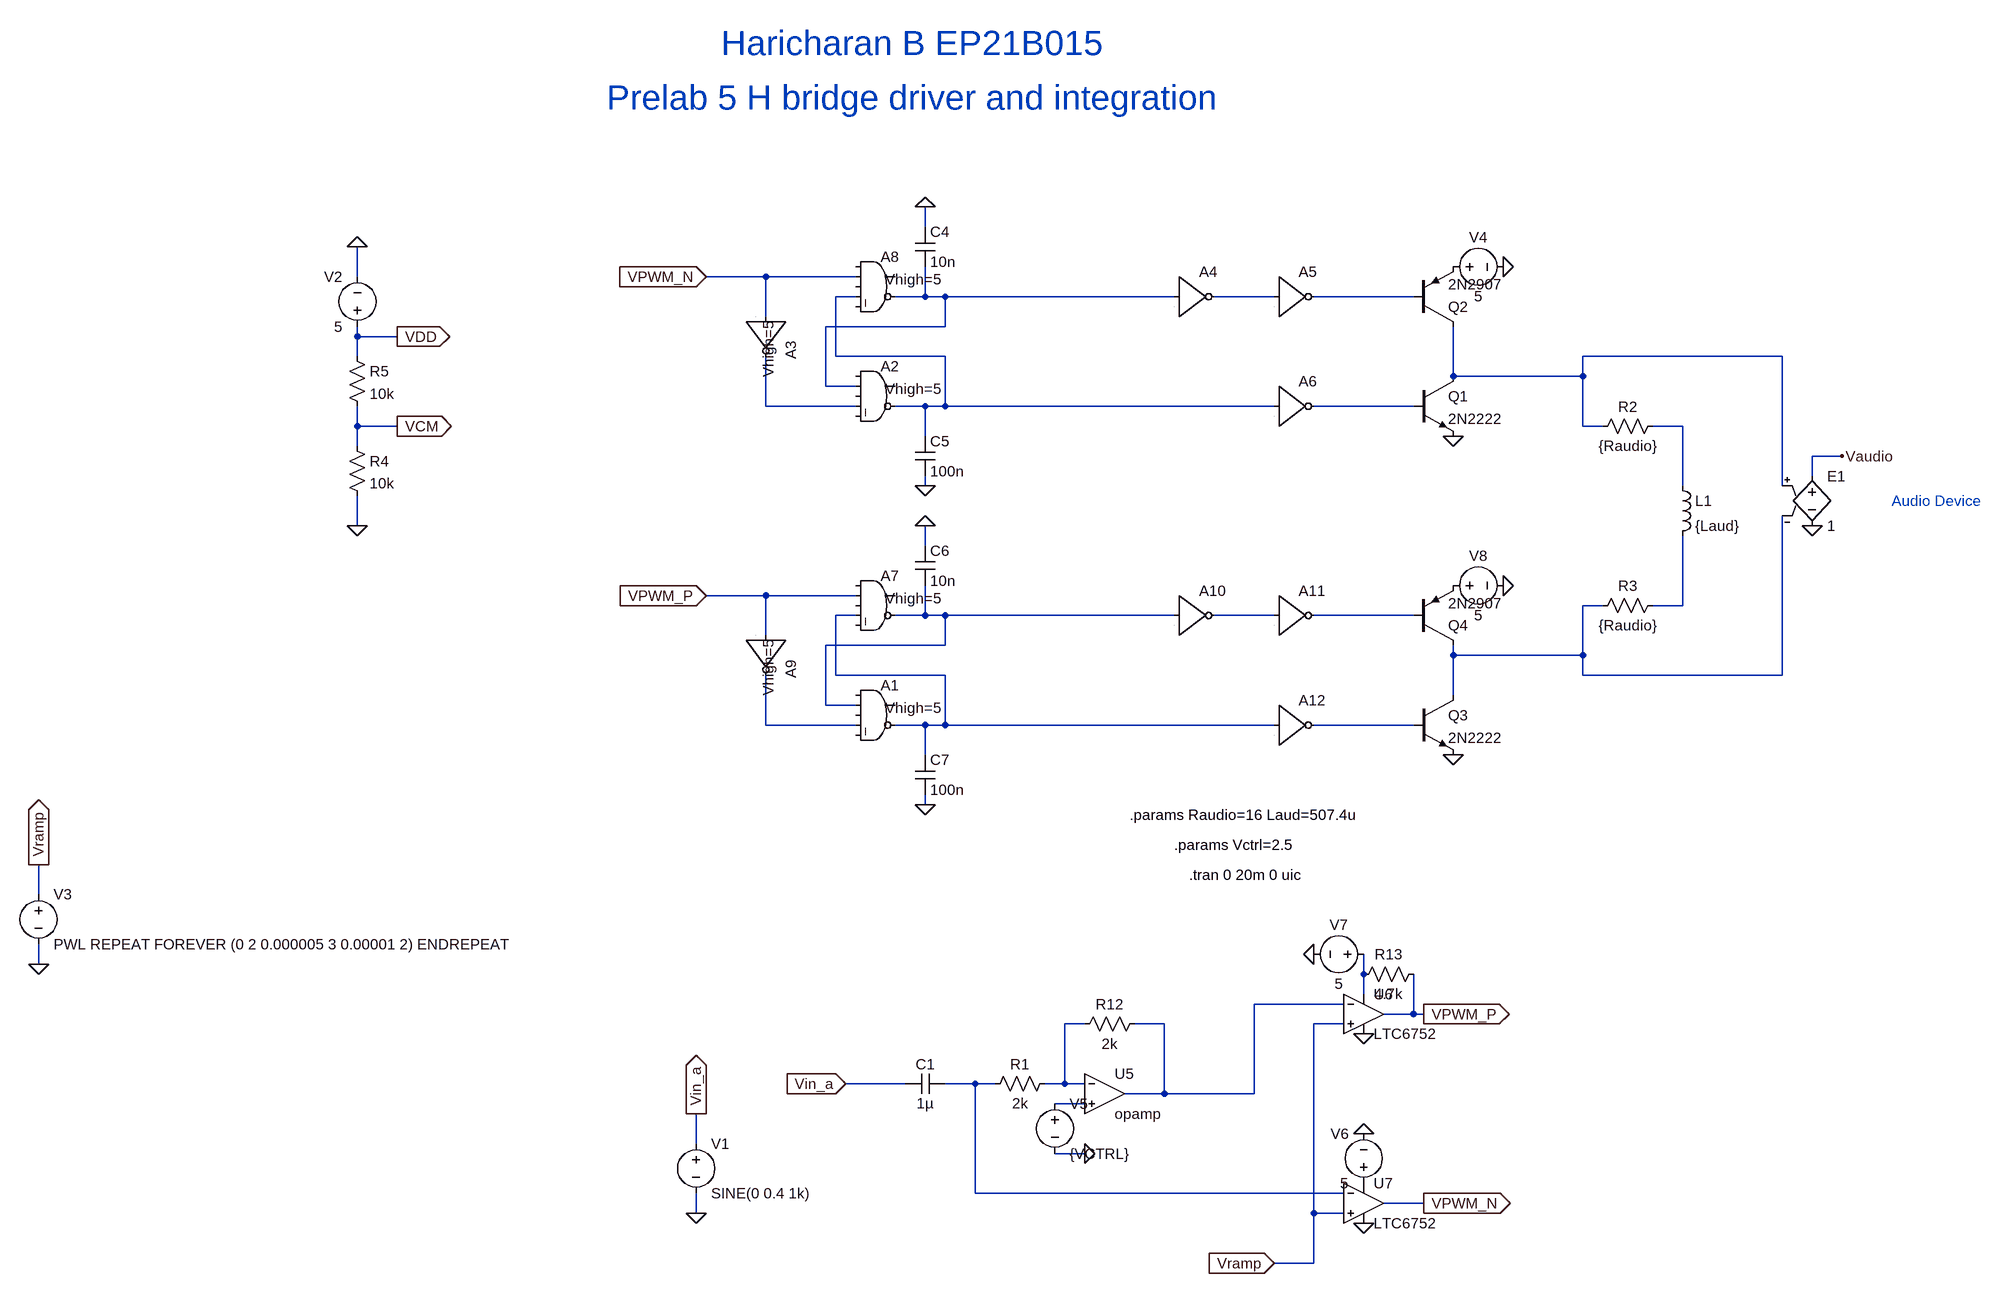
[diagram p0: schematic lab_expt_5.asc]
lab_expt_5.asc, the LTspice schematic file:
Version 4
SHEET 1 2520 1684
WIRE 816 -64 816 -96
WIRE -96 16 -96 -32
WIRE 560 16 464 16
WIRE 704 16 560 16
WIRE 704 48 672 48
WIRE 816 48 816 0
WIRE 816 48 768 48
WIRE 848 48 816 48
WIRE 1216 48 848 48
WIRE 1376 48 1280 48
WIRE 1600 48 1440 48
WIRE 560 80 560 16
WIRE 848 96 848 48
WIRE 848 96 656 96
WIRE -96 112 -96 96
WIRE -32 112 -96 112
WIRE -96 144 -96 112
WIRE 672 144 672 48
WIRE 848 144 672 144
WIRE 2192 144 1872 144
WIRE 1664 176 1664 96
WIRE 1872 176 1872 144
WIRE 1872 176 1664 176
WIRE 656 192 656 96
WIRE 704 192 656 192
WIRE 560 224 560 144
WIRE 704 224 560 224
WIRE 816 224 768 224
WIRE 848 224 848 144
WIRE 848 224 816 224
WIRE 1376 224 848 224
WIRE 1600 224 1440 224
WIRE -96 256 -96 224
WIRE -32 256 -96 256
WIRE 1872 256 1872 176
WIRE 1904 256 1872 256
WIRE 2032 256 1984 256
WIRE 816 272 816 224
WIRE -96 288 -96 256
WIRE 2288 304 2240 304
WIRE 2240 336 2240 304
WIRE 816 352 816 336
WIRE 2032 352 2032 256
WIRE 2192 352 2192 144
WIRE -96 416 -96 368
WIRE 816 448 816 416
WIRE 560 528 464 528
WIRE 704 528 560 528
WIRE 1904 544 1872 544
WIRE 2032 544 2032 432
WIRE 2032 544 1984 544
WIRE 704 560 672 560
WIRE 816 560 816 512
WIRE 816 560 768 560
WIRE 848 560 816 560
WIRE 1216 560 848 560
WIRE 1376 560 1280 560
WIRE 1600 560 1440 560
WIRE 560 592 560 528
WIRE 848 608 848 560
WIRE 848 608 656 608
WIRE 1664 624 1664 608
WIRE 1872 624 1872 544
WIRE 1872 624 1664 624
WIRE 672 656 672 560
WIRE 848 656 672 656
WIRE 1872 656 1872 624
WIRE 2192 656 2192 400
WIRE 2192 656 1872 656
WIRE 1664 688 1664 624
WIRE 656 704 656 608
WIRE 704 704 656 704
WIRE 560 736 560 656
WIRE 704 736 560 736
WIRE 816 736 768 736
WIRE 848 736 848 656
WIRE 848 736 816 736
WIRE 1376 736 848 736
WIRE 1600 736 1440 736
WIRE 816 784 816 736
WIRE 816 864 816 848
WIRE -608 1008 -608 960
WIRE -608 1120 -608 1088
WIRE 1520 1136 1520 1104
WIRE 1520 1168 1520 1136
WIRE 1488 1184 1344 1184
WIRE 1600 1200 1600 1136
WIRE 1600 1200 1552 1200
WIRE 1616 1200 1600 1200
WIRE 1072 1216 1040 1216
WIRE 1200 1216 1152 1216
WIRE 1488 1216 1440 1216
WIRE 784 1312 688 1312
WIRE 896 1312 848 1312
WIRE 928 1312 896 1312
WIRE 1040 1312 1040 1216
WIRE 1040 1312 1008 1312
WIRE 1072 1312 1040 1312
WIRE 1200 1328 1200 1216
WIRE 1200 1328 1136 1328
WIRE 1344 1328 1344 1184
WIRE 1344 1328 1200 1328
WIRE 1072 1344 1024 1344
WIRE 448 1408 448 1360
WIRE 1072 1424 1024 1424
WIRE 896 1488 896 1312
WIRE 1488 1488 896 1488
WIRE 1616 1504 1552 1504
WIRE 448 1520 448 1488
WIRE 1440 1520 1440 1216
WIRE 1488 1520 1440 1520
WIRE 1440 1600 1440 1520
WIRE 1440 1600 1376 1600
FLAG 448 1520 0
FLAG 448 1360 Vin_a
IOPIN 448 1360 Out
FLAG -96 416 0
FLAG -96 -32 0
FLAG -32 112 VDD
IOPIN -32 112 Out
FLAG -32 256 VCM
IOPIN -32 256 Out
FLAG -608 960 Vramp
IOPIN -608 960 Out
FLAG -608 1120 0
FLAG 816 352 0
FLAG 816 -96 0
FLAG 464 16 VPWM_N
IOPIN 464 16 In
FLAG 816 864 0
FLAG 816 416 0
FLAG 464 528 VPWM_P
IOPIN 464 528 In
FLAG 1376 1600 Vramp
IOPIN 1376 1600 In
FLAG 1520 1232 0
FLAG 1520 1536 0
FLAG 1072 1424 0
FLAG 1520 1392 0
FLAG 1440 1104 0
FLAG 688 1312 Vin_a
IOPIN 688 1312 In
FLAG 1616 1200 VPWM_P
IOPIN 1616 1200 Out
FLAG 1616 1504 VPWM_N
IOPIN 1616 1504 Out
FLAG 2240 416 0
FLAG 2288 304 Vaudio
FLAG 1744 0 0
FLAG 1664 272 0
FLAG 1744 512 0
FLAG 1664 784 0
SYMBOL voltage 448 1392 R0
WINDOW 123 0 0 Left 0
WINDOW 39 0 0 Left 0
SYMATTR InstName V1
SYMATTR Value SINE(0 0.4 1k)
SYMBOL res -112 272 R0
SYMATTR InstName R4
SYMATTR Value 10k
SYMBOL res -112 128 R0
SYMATTR InstName R5
SYMATTR Value 10k
SYMBOL voltage -96 112 R180
WINDOW 0 24 96 Left 2
WINDOW 3 24 16 Left 2
WINDOW 123 0 0 Left 0
WINDOW 39 0 0 Left 0
SYMATTR InstName V2
SYMATTR Value 5
SYMBOL voltage -608 992 R0
SYMATTR InstName V3
SYMATTR Value PWL REPEAT FOREVER (0 2 0.000005 3 0.00001 2) ENDREPEAT
SYMBOL Digital\\inv 624 80 R90
WINDOW 3 8 60 Left 2
SYMATTR Value Vhigh=5
SYMATTR InstName A3
SYMBOL cap 800 -64 R0
SYMATTR InstName C4
SYMATTR Value 10n
SYMBOL cap 800 272 R0
SYMATTR InstName C5
SYMATTR Value 100n
SYMBOL npn 1600 176 R0
SYMATTR InstName Q1
SYMATTR Value 2N2222
SYMBOL pnp 1600 96 M180
SYMATTR InstName Q2
SYMATTR Value 2N2907
SYMBOL Digital\\and 736 480 R0
WINDOW 3 16 52 Left 2
SYMATTR Value Vhigh=5
SYMATTR InstName A7
SYMBOL Digital\\inv 624 592 R90
WINDOW 3 8 60 Left 2
SYMATTR Value Vhigh=5
SYMATTR InstName A9
SYMBOL cap 800 448 R0
SYMATTR InstName C6
SYMATTR Value 10n
SYMBOL cap 800 784 R0
SYMATTR InstName C7
SYMATTR Value 100n
SYMBOL Digital\\inv 1216 496 R0
SYMATTR InstName A10
SYMATTR Value2 Vhigh=5 td=200n
SYMBOL npn 1600 688 R0
SYMATTR InstName Q3
SYMATTR Value 2N2222
SYMBOL pnp 1600 608 M180
SYMATTR InstName Q4
SYMATTR Value 2N2907
SYMBOL cap 848 1296 R90
WINDOW 0 0 32 VBottom 2
WINDOW 3 32 32 VTop 2
SYMATTR InstName C1
SYMATTR Value 1µ
SYMBOL res 1024 1296 R90
WINDOW 0 0 56 VBottom 2
WINDOW 3 32 56 VTop 2
SYMATTR InstName R1
SYMATTR Value 2k
SYMBOL opamp 1104 1264 R0
SYMATTR InstName U5
SYMBOL res 1168 1200 R90
WINDOW 0 0 56 VBottom 2
WINDOW 3 32 56 VTop 2
SYMATTR InstName R12
SYMATTR Value 2k
SYMBOL Comparators\\LTC6752 1520 1136 R0
SYMATTR InstName U6
SYMBOL Comparators\\LTC6752 1520 1440 R0
SYMATTR InstName U7
SYMBOL res 1616 1120 R90
WINDOW 0 0 56 VBottom 2
WINDOW 3 32 56 VTop 2
SYMATTR InstName R13
SYMATTR Value 4.7k
SYMBOL voltage 1024 1328 R0
SYMATTR InstName V5
SYMATTR Value {VCTRL}
SYMBOL voltage 1520 1488 R180
WINDOW 0 24 96 Left 2
WINDOW 3 24 16 Left 2
WINDOW 123 0 0 Left 0
WINDOW 39 0 0 Left 0
SYMATTR InstName V6
SYMATTR Value 5
SYMBOL voltage 1536 1104 R90
WINDOW 0 -32 56 VBottom 2
WINDOW 3 32 56 VTop 2
SYMATTR InstName V7
SYMATTR Value 5
SYMBOL Digital\\and 736 656 R0
WINDOW 3 16 52 Left 2
SYMATTR Value Vhigh=5
SYMATTR InstName A1
SYMBOL Digital\\and 736 144 R0
WINDOW 3 16 52 Left 2
SYMATTR Value Vhigh=5
SYMATTR InstName A2
SYMBOL Digital\\and 736 -32 R0
WINDOW 3 16 52 Left 2
SYMATTR Value Vhigh=5
SYMATTR InstName A8
SYMBOL Digital\\inv 1216 -16 R0
SYMATTR InstName A4
SYMATTR Value2 Vhigh=5
SYMBOL Digital\\inv 1376 -16 R0
SYMATTR InstName A5
SYMATTR Value2 Vhigh=5 Rout=1u
SYMBOL Digital\\inv 1376 160 R0
SYMATTR InstName A6
SYMATTR Value2 Vhigh=5 Rout=1u
SYMBOL Digital\\inv 1376 496 R0
SYMATTR InstName A11
SYMATTR Value2 Vhigh=5
SYMBOL Digital\\inv 1376 672 R0
SYMATTR InstName A12
SYMATTR Value2 Vhigh=5
SYMBOL res 2000 240 R90
WINDOW 0 0 56 VBottom 2
WINDOW 3 32 56 VTop 2
SYMATTR InstName R2
SYMATTR Value {Raudio}
SYMBOL res 2000 528 R90
WINDOW 0 0 56 VBottom 2
WINDOW 3 32 56 VTop 2
SYMATTR InstName R3
SYMATTR Value {Raudio}
SYMBOL ind 2016 336 R0
SYMATTR InstName L1
SYMATTR Value {Laud}
SYMBOL e 2240 320 R0
SYMATTR InstName E1
SYMATTR Value 1
SYMBOL voltage 1648 0 R270
WINDOW 0 32 56 VTop 2
WINDOW 3 -32 56 VBottom 2
WINDOW 123 0 0 Left 0
WINDOW 39 0 0 Left 0
SYMATTR InstName V4
SYMATTR Value 5
SYMBOL voltage 1648 512 R270
WINDOW 0 32 56 VTop 2
WINDOW 3 -32 56 VBottom 2
WINDOW 123 0 0 Left 0
WINDOW 39 0 0 Left 0
SYMATTR InstName V8
SYMATTR Value 5
TEXT 1240 976 Left 2 !.tran 0 20m 0 uic
TEXT 1216 928 Left 2 !.params Vctrl=2.5
TEXT 304 -272 Left 5 ;Prelab 5 H bridge driver and integration
TEXT 488 -360 Left 5 ;Haricharan B EP21B015
TEXT 1144 880 Left 2 !.params Raudio=16 Laud=507.4u
TEXT 2368 376 Left 2 ;Audio Device

The netlist it stands for:
* lab_expt_5.asc
V1 Vin_a 0 SINE(0 0.4 1k)
R4 VCM 0 10k
R5 VDD VCM 10k
V2 VDD 0 5
V3 Vramp 0 PWL REPEAT FOREVER (0 2 0.000005 3 0.00001 2) ENDREPEAT
A3 VPWM_N 0 0 0 0 N006 0 0 BUF Vhigh=5
C4 0 N002 10n
C5 N001 0 100n
Q1 N005 N007 0 0 2N2222
Q2 N005 N004 P001 0 2N2907
A7 0 VPWM_P 0 N011 0 N012 0 0 AND Vhigh=5
A9 VPWM_P 0 0 0 0 N015 0 0 BUF Vhigh=5
C6 0 N012 10n
C7 N011 0 100n
A10 N012 0 0 0 0 N013 0 0 BUF Vhigh=5 td=200n
Q3 N009 N016 0 0 2N2222
Q4 N009 N014 P002 0 2N2907
C1 N020 Vin_a 1µ
R1 N019 N020 2k
XU5 N019 N021 N018 opamp Aol=100K GBW=10Meg  ; pins invin noninvin out
R12 N018 N019 2k
XU6 Vramp N018 N017 0 VPWM_P LTC6752  ; pins In+ In- V+ V- OUT
XU7 Vramp N020 P003 0 VPWM_N LTC6752  ; pins In+ In- V+ V- OUT
R13 VPWM_P N017 4.7k
V5 N021 0 {VCTRL}
V6 P003 0 5
V7 N017 0 5
A1 0 N012 0 N015 0 N011 0 0 AND Vhigh=5
A2 0 N002 0 N006 0 N001 0 0 AND Vhigh=5
A8 0 VPWM_N 0 N001 0 N002 0 0 AND Vhigh=5
A4 N002 0 0 0 0 N003 0 0 BUF Vhigh=5
A5 N003 0 0 0 0 N004 0 0 BUF Vhigh=5 Rout=1u
A6 N001 0 0 0 0 N007 0 0 BUF Vhigh=5 Rout=1u
A11 N013 0 0 0 0 N014 0 0 BUF Vhigh=5
A12 N011 0 0 0 0 N016 0 0 BUF Vhigh=5
R2 N008 N005 {Raudio}
R3 N010 N009 {Raudio}
L1 N008 N010 {Laud}
E1 Vaudio 0 N005 N009 1
V4 P001 0 5
V8 P002 0 5
.model NPN NPN
.model PNP PNP
.lib standard.bjt
.tran 0 20m 0 uic
.params Vctrl=2.5
* Prelab 5 H bridge driver and integration
* Haricharan B EP21B015
.params Raudio=16 Laud=507.4u
* Audio Device
.lib LTC7.lib
.backanno
.end